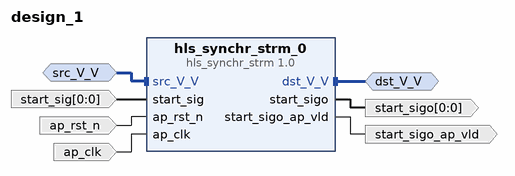
[diagram p0: block diagram of the top level]
# Vivado block design design_1, Vivado 2014.4
create_bd_design design_1

create_bd_intf_port -mode Master -vlnv xilinx.com:interface:axis_rtl:1.0 dst_V_V
create_bd_intf_port -mode Slave -vlnv xilinx.com:interface:axis_rtl:1.0 src_V_V
set_property -dict [list \
  CONFIG.TDATA_NUM_BYTES 8 \
  CONFIG.TDEST_WIDTH 0 \
  CONFIG.TID_WIDTH 0 \
  CONFIG.TUSER_WIDTH 0 \
  CONFIG.HAS_TREADY 1 \
  CONFIG.HAS_TSTRB 0 \
  CONFIG.HAS_TKEEP 0 \
  CONFIG.HAS_TLAST 0 \
  CONFIG.FREQ_HZ 100000000 \
  CONFIG.PHASE 0.000 \
  CONFIG.LAYERED_METADATA {xilinx.com:interface:datatypes:1.0 {TDATA {datatype {name {attribs {resolve_type immediate dependency {} format string minimum {} maximum {}} value {}} bitwidth {attribs {resolve_type immediate dependency {} format long minimum {} maximum {}} value 64} bitoffset {attribs {resolve_type immediate dependency {} format long minimum {} maximum {}} value 0} integer {signed {attribs {resolve_type immediate dependency {} format bool minimum {} maximum {}} value true}}}}}} \
] [get_bd_intf_ports src_V_V]
create_bd_port -dir I -from 0 -to 0 -type data start_sig
set_property -dict [list \
  CONFIG.LAYERED_METADATA {xilinx.com:interface:datatypes:1.0 {DATA {datatype {name {attribs {resolve_type immediate dependency {} format string minimum {} maximum {}} value {}} bitwidth {attribs {resolve_type immediate dependency {} format long minimum {} maximum {}} value 1} bitoffset {attribs {resolve_type immediate dependency {} format long minimum {} maximum {}} value 0}}}}} \
] [get_bd_ports start_sig]
create_bd_port -dir I -type rst ap_rst_n
create_bd_port -dir O start_sigo_ap_vld
create_bd_port -dir I -type clk ap_clk
create_bd_port -dir O -from 0 -to 0 -type data start_sigo

create_bd_cell -type ip -vlnv xilinx.com:hls:hls_synchr_strm:1.0 hls_synchr_strm_0

# ---- connections ----

connect_bd_intf_net [get_bd_intf_ports dst_V_V] [get_bd_intf_pins hls_synchr_strm_0/dst_V_V]
connect_bd_intf_net [get_bd_intf_ports src_V_V] [get_bd_intf_pins hls_synchr_strm_0/src_V_V]
connect_bd_net [get_bd_ports start_sig] [get_bd_pins hls_synchr_strm_0/start_sig]
connect_bd_net [get_bd_ports ap_rst_n] [get_bd_pins hls_synchr_strm_0/ap_rst_n]
connect_bd_net [get_bd_pins hls_synchr_strm_0/start_sigo_ap_vld] [get_bd_ports start_sigo_ap_vld]
connect_bd_net [get_bd_ports ap_clk] [get_bd_pins hls_synchr_strm_0/ap_clk]
connect_bd_net [get_bd_pins hls_synchr_strm_0/start_sigo] [get_bd_ports start_sigo]

validate_bd_design
save_bd_design
